# EAGLE design oTFTeatherWing-LT7688 (EAGLE 9.6.0)
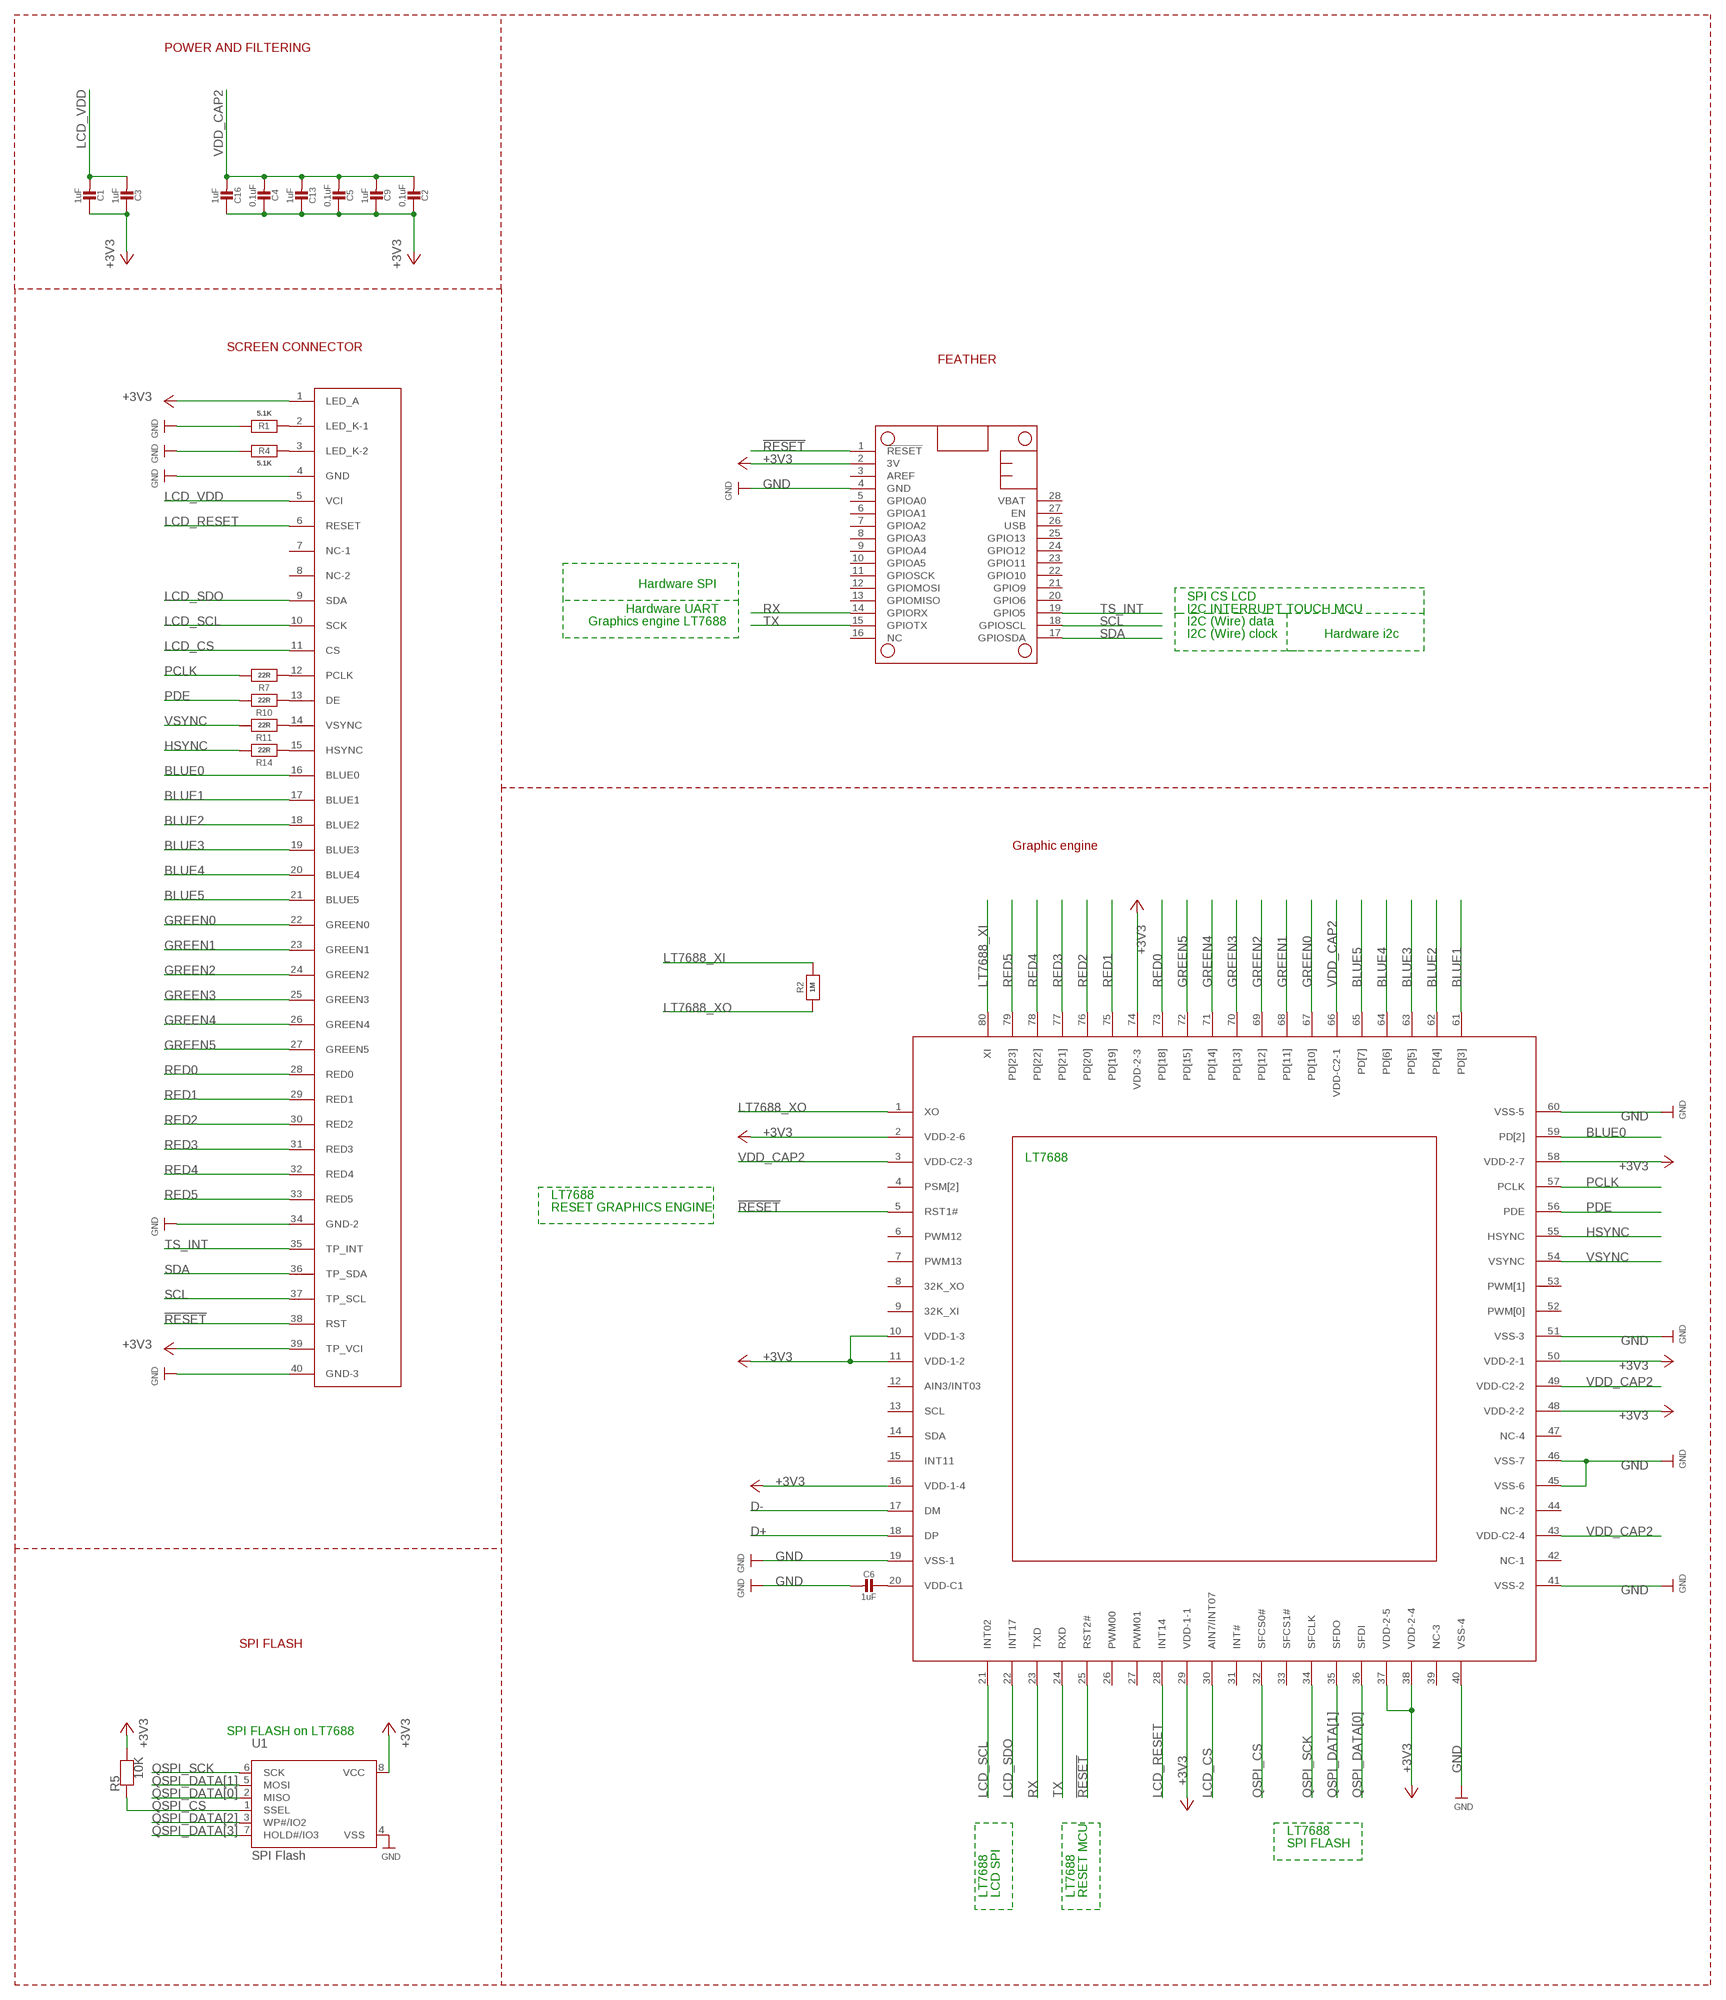
[diagram p0: schematic, sheet 1]

## Parts
C1  1uF  CAP_CERAMIC0603_NO  [0603-NO]
C2  0.1uF  CAP_CERAMIC0603_NO  [0603-NO]
C3  1uF  CAP_CERAMIC0603_NO  [0603-NO]
C4  0.1uF  CAP_CERAMIC0603_NO  [0603-NO]
C5  0.1uF  CAP_CERAMIC0603_NO  [0603-NO]
C6  1uF  CAP_CERAMIC0603_NO  [0603-NO]
C9  1uF  CAP_CERAMIC0603_NO  [0603-NO]
C13  1uF  CAP_CERAMIC0603_NO  [0603-NO]
C16  1uF  CAP_CERAMIC0603_NO  [0603-NO]
MS2  FEATHERWING  [FEATHERWING]
R1  5.1K  RESISTOR_0603_NOOUT  [0603-NO]
R2  1M  RESISTOR_0603_NOOUT  [0603-NO]
R4  5.1K  RESISTOR_0603_NOOUT  [0603-NO]
R5  10K  RESISTOR_0603_NOOUT  [0603-NO]
R7  22R  RESISTOR_0603_NOOUT  [0603-NO]
R10  22R  RESISTOR_0603_NOOUT  [0603-NO]
R11  22R  RESISTOR_0603_NOOUT  [0603-NO]
R14  22R  RESISTOR_0603_NOOUT  [0603-NO]
U1  SPI Flash  SPIFLASH_8PINUX  [USON8]
U$1  LT7688  [QFN40P900X900X70-81T710N]
U$2  FPC-LCD  [XF2M-4015-1F-REVERSE]

## Nets
!RESET: MS2.1(!RESET) U$1.5(RST1#) U$1.25(RST2#) U$2.38(RST)
+3V3 [power]: C1.1 C2.1 C3.1 C4.1 C5.1 C9.1 C13.1 C16.1 MS2.2(3V) R5.2 U1.8(VCC) U$1.2(VDD-2-6) U$1.10(VDD-1-3) U$1.11(VDD-1-2) U$1.16(VDD-1-4) U$1.29(VDD-1-1) U$1.37(VDD-2-5) U$1.38(VDD-2-4) U$1.48(VDD-2-2) U$1.50(VDD-2-1) U$1.58(VDD-2-7) U$1.74(VDD-2-3) U$2.1(LED_A) U$2.39(TP_VCI)
BLUE0: U$1.59(PD[2]) U$2.16(BLUE0)
BLUE1: U$1.61(PD[3]) U$2.17(BLUE1)
BLUE2: U$1.62(PD[4]) U$2.18(BLUE2)
BLUE3: U$1.63(PD[5]) U$2.19(BLUE3)
BLUE4: U$1.64(PD[6]) U$2.20(BLUE4)
BLUE5: U$1.65(PD[7]) U$2.21(BLUE5)
D+: U$1.18(DP)
D-: U$1.17(DM)
GND [power]: C6.2 MS2.4(GND) R1.1 R4.1 U1.4(VSS) U$1.19(VSS-1) U$1.40(VSS-4) U$1.41(VSS-2) U$1.45(VSS-6) U$1.46(VSS-7) U$1.51(VSS-3) U$1.60(VSS-5) U$2.4(GND) U$2.34(GND-2) U$2.40(GND-3)
GREEN0: U$1.67(PD[10]) U$2.22(GREEN0)
GREEN1: U$1.68(PD[11]) U$2.23(GREEN1)
GREEN2: U$1.69(PD[12]) U$2.24(GREEN2)
GREEN3: U$1.70(PD[13]) U$2.25(GREEN3)
GREEN4: U$1.71(PD[14]) U$2.26(GREEN4)
GREEN5: U$1.72(PD[15]) U$2.27(GREEN5)
HSYNC: R14.2 U$1.55(HSYNC)
LCD_CS: U$1.30(AIN7/INT07) U$2.11(CS)
LCD_RESET: U$1.28(INT14) U$2.6(RESET)
LCD_SCL: U$1.21(INT02) U$2.10(SCK)
LCD_SDO: U$1.22(INT17) U$2.9(SDA)
LCD_VDD: C1.2 C3.2 U$2.5(VCI)
LT7688_XI: R2.2 U$1.80(XI)
LT7688_XO: R2.1 U$1.1(XO)
N$2: R1.2 U$2.2(LED_K-1)
N$3: C6.1 U$1.20(VDD-C1)
N$5: R4.2 U$2.3(LED_K-2)
N$6: R7.1 U$2.12(PCLK)
N$7: R10.1 U$2.13(DE)
N$8: R11.1 U$2.14(VSYNC)
N$9: R14.1 U$2.15(HSYNC)
PCLK: R7.2 U$1.57(PCLK)
PDE: R10.2 U$1.56(PDE)
QSPI_CS: R5.1 U1.1(SSEL) U$1.32(SFCS0#)
QSPI_DATA[0]: U1.2(MISO) U$1.36(SFDI)
QSPI_DATA[1]: U1.5(MOSI) U$1.35(SFDO)
QSPI_DATA[2]: U1.3(WP#/IO2)
QSPI_DATA[3]: U1.7(HOLD#/IO3)
QSPI_SCK: U1.6(SCK) U$1.34(SFCLK)
RED0: U$1.73(PD[18]) U$2.28(RED0)
RED1: U$1.75(PD[19]) U$2.29(RED1)
RED2: U$1.76(PD[20]) U$2.30(RED2)
RED3: U$1.77(PD[21]) U$2.31(RED3)
RED4: U$1.78(PD[22]) U$2.32(RED4)
RED5: U$1.79(PD[23]) U$2.33(RED5)
RX: MS2.14(GPIORX) U$1.23(TXD)
SCL: MS2.18(GPIOSCL) U$2.37(TP_SCL)
SDA: MS2.17(GPIOSDA) U$2.36(TP_SDA)
TS_INT: MS2.19(GPIO5) U$2.35(TP_INT)
TX: MS2.15(GPIOTX) U$1.24(RXD)
VDD_CAP2: C2.2 C4.2 C5.2 C9.2 C13.2 C16.2 U$1.3(VDD-C2-3) U$1.43(VDD-C2-4) U$1.49(VDD-C2-2) U$1.66(VDD-C2-1)
VSYNC: R11.2 U$1.54(VSYNC)
Unconnected: MS2.3(AREF) MS2.5(GPIOA0) MS2.6(GPIOA1) MS2.7(GPIOA2) MS2.8(GPIOA3) MS2.9(GPIOA4) MS2.10(GPIOA5) MS2.11(GPIOSCK) MS2.12(GPIOMOSI) MS2.13(GPIOMISO) MS2.16(NC) MS2.20(GPIO6) MS2.21(GPIO9) MS2.22(GPIO10) MS2.23(GPIO11) MS2.24(GPIO12) MS2.25(GPIO13) MS2.26(USB) MS2.27(EN) MS2.28(VBAT) U$1.4(PSM[2]) U$1.6(PWM12) U$1.7(PWM13) U$1.8(32K_XO) U$1.9(32K_XI) U$1.12(AIN3/INT03) U$1.13(SCL) U$1.14(SDA) U$1.15(INT11) U$1.26(PWM00) U$1.27(PWM01) U$1.31(INT#) U$1.33(SFCS1#) U$1.39(NC-3) U$1.42(NC-1) U$1.44(NC-2) U$1.47(NC-4) U$1.52(PWM[0]) U$1.53(PWM[1]) U$2.7(NC-1) U$2.8(NC-2)

## Notes on the sheet
- POWER AND FILTERING
- SCREEN CONNECTOR
- FEATHER
- Hardware SPI
- SPI CS LCD
- Hardware UART | I2C INTERRUPT TOUCH MCU
- Graphics engine LT7688 | I2C (Wire) data
- I2C (Wire) clock | Hardware i2c
- Graphic engine
- LT7688
- LT7688
- RESET GRAPHICS ENGINE
- SPI FLASH
- SPI FLASH on LT7688
- LT7688
- SPI FLASH
- LT7688 | LCD SPI | LT7688 | RESET MCU

## Library data of the parts
C1-C6 C9 C13 C16 = microbuilder:CAP_CERAMIC: Ceramic Capacitors For new designs, use the packages preceded by an '_' character since they are more reliable: The following footprints should be used on most boards: _0402 - Standard footprint for regular board layouts _0603 - Standard footprint for regular board layouts _0805 - Standard footprint for regular board layouts _1206 - Standard footprint for regular board layouts For extremely tight-pitch boards where space is at a premium, the following 'micro-pitch' footprints can be used (smaller pads, no silkscreen outline, etc.): _0402MP - Micro-pitch footprint for very dense/compact boards _0603MP - Micro-pitch footprint for very dense/compact boards _0805MP - Micro-pitch footprint for very dense/compact boards _1206MP - Micro-pitch footprint for very dense/compact boards
MS2 = adafruit:FEATHERWING
R1 R2 R4 R5 R7 R10 R11 R14 = microbuilder:RESISTOR: Resistors For new designs, use the packages preceded by an '_' character since they are more reliable: The following footprints should be used on most boards: _0402 - Standard footprint for regular board layouts _0603 - Standard footprint for regular board layouts _0805 - Standard footprint for regular board layouts _1206 - Standard footprint for regular board layouts For extremely tight-pitch boards where space is at a premium, the following 'micro-pitch' footprints can be used (smaller pads, no silkscreen outline, etc.): _0402MP - Micro-pitch footprint for very dense/compact boards _0603MP - Micro-pitch footprint for very dense/compact boards _0805MP - Micro-pitch footprint for very dense/compact boards _1206MP - Micro-pitch footprint for very dense/compact boards
U1 = microbuilder:SPIFLASH_8PIN: SOIC8 SPI Flash Be careful with the size since SOIC8 flash comes in several 'widths' SOIC8 150 mil M25P16 - 16Mbit (2Mbit x 8) Serial Flash (75MHz SPI Bus), Supply: 2.7-3.6V Digikey: SOIC8 - M25P16-VMN6P-ND SOIC8 208 mil W25Q16BVSSIG - 16Mbit (2Mbit x 8) Serial Flash (104MHz SPI Bus), Supply: 2.7-3.6V Digikey: SOIC8 - W25Q16BVSSIG-ND
U$1 = QFN40P900X900X70-81T710N:LT7688
U$2 = QFN40P900X900X70-81T710N:FPC-LCD

## Net classes
1 power: width 0.305 mm

## Board
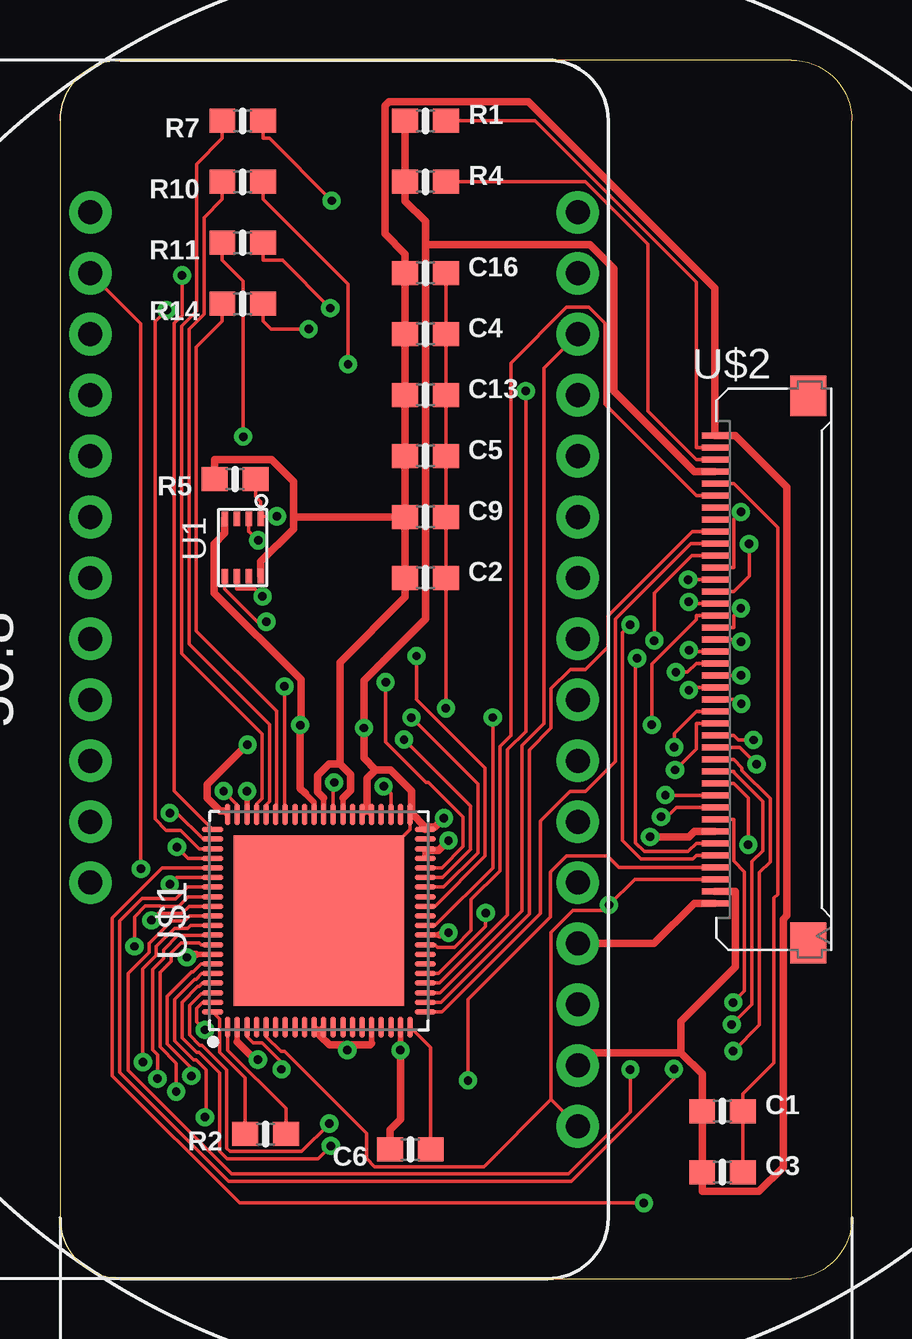
[diagram p1: board, top side]
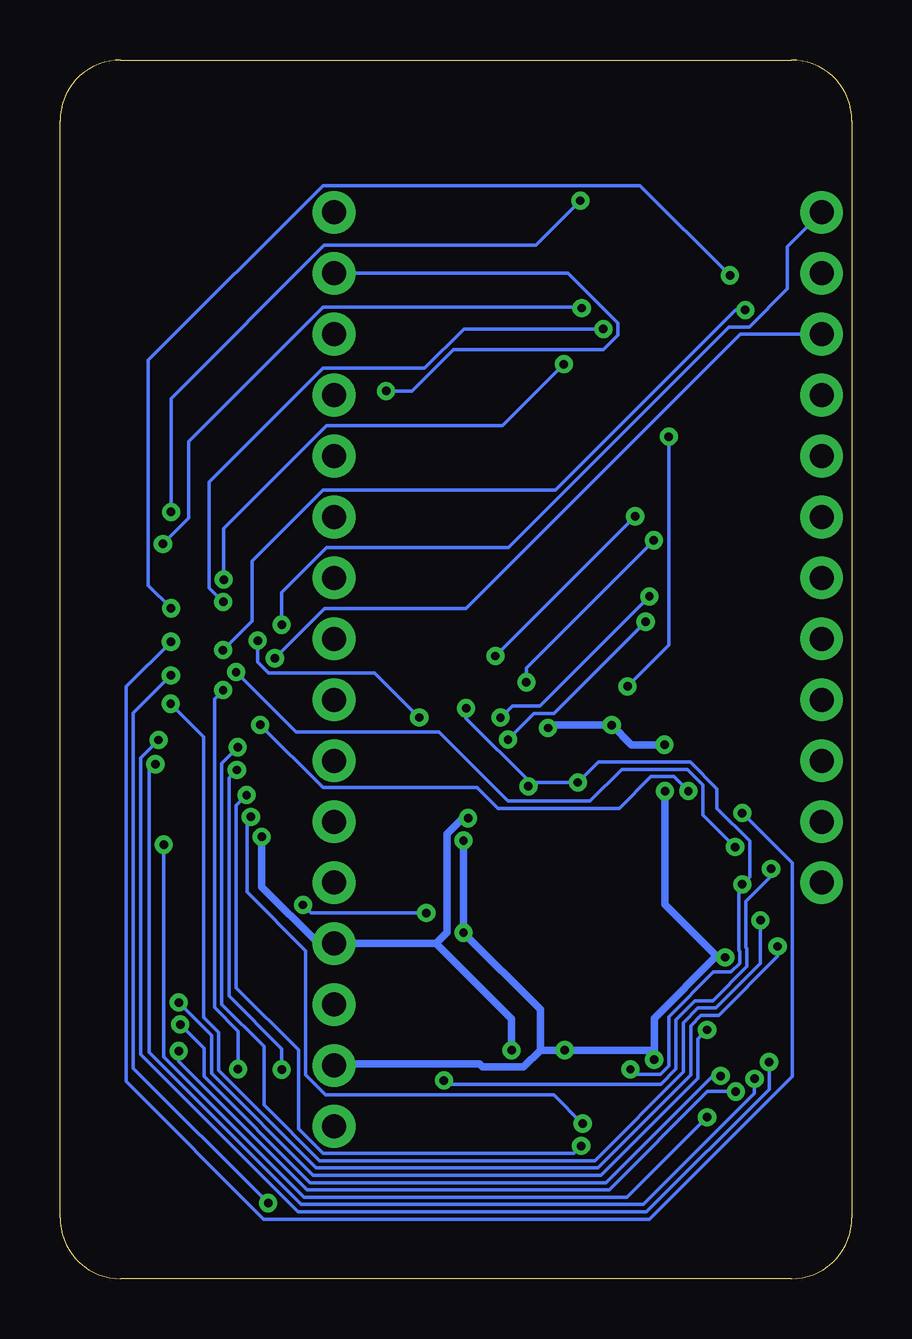
[diagram p2: board, bottom side, seen from below]

Size 33.02 x 50.8 mm. Coordinates in mm from the lower left corner, seen from the top.
Outline: 2.54,0 arc-90 0,2.54 0,48.26 arc-90 2.54,50.8 30.48,50.8 arc-90 33.02,48.26 33.02,2.54 arc-90 30.48,0 2.54,0
Copper layers (1*16): Top 0.035mm / dielectric 1.5mm / Bottom 0.035mm
Design rules "default": minimum track width 6mil, minimum drill 0.35mm, track to track 6mil, track to pad 6mil, pad to pad 6mil, via to via 6mil, smd to smd 6mil, copper to edge 40mil, drill to drill 6mil, minimum pad ring 10mil, minimum via ring 8mil, stop-mask expansion 4mil, vias tented up to drill 0mil, thermal gap 10mil

### Footprints (pad centres in the part's own frame; a part is rotated, then mirrored left to right if it is on the bottom)
0603-NO = smd 1.075 x 1: 1 -0.85,0; 2 0.85,0
FEATHERWING = drill 1 pad 1.778: 1 6.35,1.27; 2 8.89,1.27; 3 11.43,1.27; 4 13.97,1.27; 5 16.51,1.27; 6 19.05,1.27; 7 21.59,1.27; 8 24.13,1.27; 9 26.67,1.27; 10 29.21,1.27; 11 31.75,1.27; 12 34.29,1.27; 13 36.83,1.27; 14 39.37,1.27; 15 41.91,1.27; 16 44.45,1.27; 17 44.45,21.59; 18 41.91,21.59; 19 39.37,21.59; 20 36.83,21.59; 21 34.29,21.59; 22 31.75,21.59; 23 29.21,21.59; 24 26.67,21.59; 25 24.13,21.59; 26 21.59,21.59; 27 19.05,21.59; 28 16.51,21.59
USON8 = smd 0.6 x 0.275: 1 -1.2,0.75; 2 -1.2,0.25; 3 -1.2,-0.25; 4 -1.2,-0.75; 5 1.2,-0.75; 6 1.2,-0.25; 7 1.2,0.25; 8 1.2,0.75
QFN40P900X900X70-81T710N = smd 0.873 x 0.22: 1 -4.428,3.8; 2 -4.428,3.4; 3 -4.428,3; 4 -4.428,2.6; 5 -4.428,2.2; 6 -4.428,1.8; 7 -4.428,1.4; 8 -4.428,1; 9 -4.428,0.6; 10 -4.428,0.2; 11 -4.428,-0.2; 12 -4.428,-0.6; 13 -4.428,-1; 14 -4.428,-1.4; 15 -4.428,-1.8; 16 -4.428,-2.2; 17 -4.428,-2.6; 18 -4.428,-3; 19 -4.428,-3.4; 20 -4.428,-3.8; 41 4.428,-3.8; 42 4.428,-3.4; 43 4.428,-3; 44 4.428,-2.6; 45 4.428,-2.2; 46 4.428,-1.8; 47 4.428,-1.4; 48 4.428,-1; 49 4.428,-0.6; 50 4.428,-0.2; 51 4.428,0.2; 52 4.428,0.6; 53 4.428,1; 54 4.428,1.4; 55 4.428,1.8; 56 4.428,2.2; 57 4.428,2.6; 58 4.428,3; 59 4.428,3.4; 60 4.428,3.8 | smd 0.22 x 0.873: 21 -3.8,-4.428; 22 -3.4,-4.428; 23 -3,-4.428; 24 -2.6,-4.428; 25 -2.2,-4.428; 26 -1.8,-4.428; 27 -1.4,-4.428; 28 -1,-4.428; 29 -0.6,-4.428; 30 -0.2,-4.428; 31 0.2,-4.428; 32 0.6,-4.428; 33 1,-4.428; 34 1.4,-4.428; 35 1.8,-4.428; 36 2.2,-4.428; 37 2.6,-4.428; 38 3,-4.428; 39 3.4,-4.428; 40 3.8,-4.428; 61 3.8,4.428; 62 3.4,4.428; 63 3,4.428; 64 2.6,4.428; 65 2.2,4.428; 66 1.8,4.428; 67 1.4,4.428; 68 1,4.428; 69 0.6,4.428; 70 0.2,4.428; 71 -0.2,4.428; 72 -0.6,4.428; 73 -1,4.428; 74 -1.4,4.428; 75 -1.8,4.428; 76 -2.2,4.428; 77 -2.6,4.428; 78 -3,4.428; 79 -3.4,4.428; 80 -3.8,4.428 | smd 7.1 x 7.1: 81 0,0
XF2M-4015-1F-REVERSE = smd 1.1 x 0.25: 1 -2.54,9.75; 2 -2.54,9.25; 3 -2.54,8.75; 4 -2.54,8.25; 5 -2.54,7.75; 6 -2.54,7.25; 7 -2.54,6.75; 8 -2.54,6.25; 9 -2.54,5.75; 10 -2.54,5.25; 11 -2.54,4.75; 12 -2.54,4.25; 13 -2.54,3.75; 14 -2.54,3.25; 15 -2.54,2.75; 16 -2.54,2.25; 17 -2.54,1.75; 18 -2.54,1.25; 19 -2.54,0.75; 20 -2.54,0.25; 21 -2.54,-0.25; 22 -2.54,-0.75; 23 -2.54,-1.25; 24 -2.54,-1.75; 25 -2.54,-2.25; 26 -2.54,-2.75; 27 -2.54,-3.25; 28 -2.54,-3.75; 29 -2.54,-4.25; 30 -2.54,-4.75; 31 -2.54,-5.25; 32 -2.54,-5.75; 33 -2.54,-6.25; 34 -2.54,-6.75; 35 -2.54,-7.25; 36 -2.54,-7.75; 37 -2.54,-8.25; 38 -2.54,-8.75; 39 -2.54,-9.25; 40 -2.54,-9.75 | smd 1.5 x 1.7: M1 1.36,11.4; M2 1.36,-11.4

### Placement (x,y rotation side)
C1  27.62,6.98 0 top
C2  15.24,29.21 0 top
C3  27.62,4.45 0 top
C4  15.24,39.37 0 top
C5  15.24,34.29 0 top
C6  14.6,5.4 180 top
C9  15.24,31.75 0 top
C13  15.24,36.83 0 top
C16  15.24,41.91 0 top
MS2  22.86,0 90 top
R1  15.24,48.26 0 top
R2  8.57,6.03 180 top
R4  15.24,45.72 0 top
R5  7.3,33.34 180 top
R7  7.62,48.26 180 top
R10  7.62,45.72 180 top
R11  7.62,43.18 180 top
R14  7.62,40.64 180 top
U1  7.62,30.48 270 top
U$1  10.79,14.92 90 top
U$2  29.84,25.4 0 top

### Tracks (layer width: path | path; a pad name or v marks a point on that pad's centre or on a via)
!RESET  (via drill 0.35 pad 0.76)
  Top 0.152: 20.47,7.47 MS2.1 | 20.47,7.47 20.47,14.44 21.38,15.35 22.66,15.35 v22.89,15.58 23.96,16.65 U$2.38 | 20.47,7.47 17.67,4.67 13.12,4.67 12.77,5.02 12.77,6.05 9.35,9.47 9.21,9.47 8.6,10.09 U$1.5 | v17.75,15.24 17.75,14.68 15.79,12.72 U$1.25
  Bottom 0.152: v22.89,15.58 22.55,15.24 v17.75,15.24
+3V3  (via drill 0.35 pad 0.76)
  Top 0.22: 7.39,9.86 U$1.2 | 12.99,9.8 U$1.16 | 10.74,10.35 U$1.10 | 10.85,10.35 U$1.11 | 10.99,20.03 U$1.50 | 11.79,20.03 U$1.48 | 7.79,20.04 U$1.58 | 15.3,17.84 U$1.38 U$1.37 | 5.68,13.52 U$1.74 | 15.83,14.32 U$1.29
  Top 0.305: 7.39,9.86 8.12,9.13 v8.25,9.13 | v11.98,9.53 11.98,9.75 | 11.98,9.75 11.23,9.75 10.85,10.12 10.85,10.35 10.74,10.35 | 11.98,9.75 12.94,9.75 12.99,9.8 | 11.79,20.03 12.12,20.35 12.12,21.02 11.68,21.46 | 7.79,20.04 v7.79,20.32 | 15.83,14.32 16.1,14.32 v16.2,14.42 | 11.68,21.46 11.68,25.7 14.39,28.41 C2.1 14.39,30.95 C9.1 | 11.68,21.46 11.23,21.46 10.75,20.98 10.75,20.28 10.99,20.03 | 9.73,31.75 9.73,31.25 8.37,29.88 U1.8 | 9.73,31.75 9.73,33.23 8.82,34.14 6.45,34.14 R5.2 | 9.73,31.75 13.55,31.75 C9.1 | 5.68,13.52 5.42,13.52 v5.29,13.39 | 25.89,9.42 26.77,8.53 26.77,7.79 C1.1 26.77,6.18 26.77,5.25 26.77,4.73 C3.1 26.77,3.64 29.14,3.64 30.15,4.65 30.15,14.98 30.31,15.13 30.31,33 28.16,35.15 U$2.1 27.3,41.29 19.53,49.07 13.72,49.07 13.55,48.89 13.55,43.56 14.39,42.71 C16.1 C4.1 14.39,38.56 14.39,37.63 C13.1 14.39,36.02 C5.1 C9.1 | 25.89,9.42 25.89,10.73 28.16,13 28.16,16.15 U$2.39 | 25.89,9.42 22.12,9.42 MS2.2 | 15.3,17.84 15.78,17.84 v16.2,18.26
  Bottom 0.305: 8.25,9.53 v8.25,9.13 | 8.25,9.53 v11.98,9.53 12.99,9.53 | 5.64,13.46 8.25,10.86 8.25,9.53 | 5.64,13.46 7.79,15.61 v7.79,20.32 | v7.79,20.32 | v16.2,18.26 v16.2,14.42 12.99,11.22 12.99,9.53 | 5.64,13.46 5.36,13.46 v5.29,13.39 | MS2.2 21.53,8.95 15.53,8.95 15.41,8.83 13.69,8.83 12.99,9.53
BLUE0  (via drill 0.35 pad 0.76)
  Top 0.152: v24.67,23.09 24.67,25.62 26.53,27.48 26.53,27.65 U$2.16 | v6.82,20.33 7.39,19.75 U$1.59
  Bottom 0.152: v6.82,20.33 7.42,20.93 8.38,20.93 9.69,19.61 14.77,19.61 15.63,20.47 22.05,20.47 v24.67,23.09
BLUE1  (via drill 0.35 pad 0.76)
  Top 0.152: U$1.61 4.77,20.32 4.77,39.83 5.09,40.15 v5.09,41.82 | v28.39,27.95 28.08,27.64 28.08,27.15 U$2.17
  Bottom 0.152: v28.39,27.95 29.34,28.9 29.34,38.28 22.05,45.57 8.83,45.57 v5.09,41.82
BLUE2  (via drill 0.35 pad 0.76)
  Top 0.152: v28.4,26.55 28.18,26.55 28.08,26.65 U$2.18 | v4.57,19.41 4.87,19.41 5.96,18.32 U$1.62
  Bottom 0.152: v4.57,19.41 2.49,17.33 2.49,8.43 8.44,2.48 24.52,2.48 30.27,8.22 30.27,24.68 v28.4,26.55
BLUE3  (via drill 0.35 pad 0.76)
  Top 0.152: U$1.63 5.8,17.92 5.03,18.69 4.43,18.69 3.97,19.16 3.97,39.89 v4.45,40.38 | U$2.19 26.27,26.15 v26.22,26.2
  Bottom 0.152: v26.22,26.2 25.01,27.42 25.01,29.92 22.05,32.87 12.36,32.87 4.86,40.38 v4.45,40.38
BLUE4  (via drill 0.35 pad 0.76)
  Top 0.152: v25.68,25.29 26.16,25.29 26.53,25.65 U$2.20 | v4.88,17.99 5.35,17.52 U$1.64
  Bottom 0.152: v4.88,17.99 6.21,19.33 6.21,20.58 6.87,21.24 9.6,21.24 10.92,19.91 14.34,19.91 17.21,22.78 23.18,22.78 v25.68,25.29
BLUE5  (via drill 0.35 pad 0.76)
  Top 0.152: v24.34,3.15 7.49,3.15 2.19,8.46 2.19,15.04 4.27,17.12 U$1.65 | U$2.21 v28.4,25.15
  Bottom 0.152: v28.4,25.15 29.96,23.58 29.96,8.78 v24.34,3.15
GND  (via drill 0.35 pad 0.76)
  Top 0.152: U$1.41 14.6,18.72 13.97,18.1
  Top 0.22: 12.74,19.49 U$1.46 | 12.85,19.49 U$1.45 | 6.85,19.49 U$1.60 | 14.65,19.41 U$1.41 | 10.23,20.22 10.23,20.21 10.6,19.84 U$1.51 | 15.22,18.74 U$1.40 | 14.19,9.8 U$1.19
  Top 0.305: 15.23,43.1 15.23,44.07 14.39,44.91 R4.1 R1.1 | 15.23,43.1 15.23,27.49 12.67,24.93 v12.67,22.96 12.67,21.7 13.17,21.21 | 15.23,43.1 22.09,43.1 23.1,42.09 23.1,37 26.45,33.65 U$2.4 | 12.81,19.54 12.85,19.49 | 13.17,21.21 12.81,20.85 12.81,19.54 | 12.81,19.54 12.78,19.54 12.74,19.49 | v7.82,22.26 7.79,22.26 6.14,20.61 6.14,20.04 6.69,19.49 6.85,19.49 | 13.17,21.21 13.78,21.21 14.65,20.33 14.65,19.41 15.22,18.83 | 15.22,18.83 15.22,18.74 | 15.22,18.83 15.64,18.83 v16,19.19 | v24.61,18.42 26.22,18.42 26.45,18.65 U$2.34 | U$2.40 26.45,15.65 24.77,13.97 MS2.4 | 10.23,20.22 10.02,20.43 v10.02,23.07 10.04,23.1 10.04,24.97 6.43,28.59 6.43,30.63 6.87,31.08 U1.4 | C6.2 13.76,6.2 14.19,6.64 v14.19,9.52 14.19,9.8
  Bottom 0.305: v12.67,22.96 12.56,23.07 v10.02,23.07 9.2,22.26 v7.82,22.26 | v24.61,18.42 24.61,16.33 22.24,13.97 MS2.4 17.34,13.97 | 17.34,13.97 16.88,14.43 16.88,18.54 16.23,19.19 v16,19.19 | 17.34,13.97 14.19,10.82 v14.19,9.52
GREEN0  (via drill 0.35 pad 0.76)
  Top 0.152: v25.6,8.74 25.6,8.34 21.31,4.05 7.04,4.05 2.5,8.59 2.5,14.92 3.43,15.85 4.3,15.85 4.32,15.83 4.83,15.83 5.32,16.32 U$1.67 | U$2.22 26.34,24.65 v26.22,24.53
  Bottom 0.152: v25.6,8.74 | v25.6,8.74 25.6,10.32 26.58,11.3 26.58,24.17 v26.22,24.53
GREEN1  (via drill 0.35 pad 0.76)
  Top 0.152: v3.11,13.85 3.11,15.09 3.56,15.55 4.18,15.55 4.2,15.53 4.95,15.53 5.35,15.92 U$1.68 | U$2.23 28.22,24.15 v28.4,23.96
  Bottom 0.152: v3.11,13.85 3.11,13.43 5.56,10.98 6.29,10.98 6.73,10.54 6.73,8.49 10.6,4.62 22.34,4.62 26.4,8.68 26.4,10.28 27.02,10.9 27.02,22.58 v28.4,23.96
GREEN2  (via drill 0.35 pad 0.76)
  Top 0.152: v3.81,14.94 4.1,15.22 5.08,15.22 5.38,15.52 U$1.69 | v25.61,22.15 25.61,22.73 26.53,23.65 U$2.24
  Bottom 0.152: v3.81,14.94 3.81,13.15 5.69,11.28 6.42,11.28 7.03,10.67 7.03,8.62 10.72,4.92 22.19,4.92 24.51,7.25 24.51,9.68 26.28,11.45 26.28,21.48 v25.61,22.15
GREEN3  (via drill 0.35 pad 0.76)
  Top 0.152: v25.65,21.21 26.53,22.09 26.53,23.15 U$2.25 | v23.77,8.72 23.77,6.95 21.19,4.36 7.16,4.36 2.85,8.68 2.85,12.74 3.71,13.6 3.71,13.97 4.66,14.92 5.21,14.92 5.41,15.12 U$1.70
  Bottom 0.152: v23.77,8.72 23.77,9.59 25.97,11.79 25.97,20.88 v25.65,21.21
GREEN4  (via drill 0.35 pad 0.76)
  Top 0.152: v3.46,9.03 3.46,12.91 4.02,13.47 4.02,13.84 4.78,14.61 5.33,14.61 5.44,14.72 U$1.71 | v28.91,22.45 28.28,22.45 28.08,22.65 U$2.26
  Bottom 0.152: v28.91,22.45 29.65,21.71 29.65,9.35 23.09,2.79 8.57,2.79 3.46,7.9 v3.46,9.03
GREEN5  (via drill 0.35 pad 0.76)
  Top 0.152: v4.06,8.34 4.06,9.34 3.87,9.53 3.87,12.89 4.32,13.35 4.32,13.71 4.92,14.31 6.35,14.31 U$1.72 | U$2.27 28.34,22.15 v29.04,21.44
  Bottom 0.152: v29.04,21.44 29.3,21.18 29.3,9.43 22.97,3.09 8.7,3.09 4.06,7.72 v4.06,8.34
HSYNC
  Top 0.152: U$1.55 9.03,19.39 9.03,23.66 5.69,27 5.69,38.83 6.77,39.91 R14.2
LCD_CS  (via drill 0.35 pad 0.76)
  Top 0.152: U$2.11 26.34,30.15 24.78,28.59 v24.78,26.6 | U$1.30 15.63,14.72 18.04,17.13 v18.04,23.39
  Bottom 0.152: v18.04,23.39 19.9,25.26 24.31,25.26 24.78,25.72 v24.78,26.6 | v24.78,26.6
LCD_RESET
  Top 0.152: U$1.28 15.63,13.92 15.74,13.81 16.45,13.81 17.14,14.51 17.14,15.8 18.35,17 18.35,22.18 18.8,22.63 18.8,38.17 21.12,40.49 22.06,40.49 22.72,39.83 22.72,36.46 26.53,32.65 U$2.6
LCD_SCL
  Top 0.152: U$1.21 15.92,11.12 20.02,15.23 20.02,19.07 21.27,20.32 21.91,20.32 23.15,21.56 23.15,27.49 26.31,30.65 U$2.10
LCD_SDO
  Top 0.152: U$1.22 15.88,11.52 19.57,15.21 19.57,22.04 20.47,22.95 20.47,24.59 21.28,25.4 21.91,25.4 22.85,26.34 22.85,27.62 26.37,31.15 U$2.9
LCD_VDD
  Top 0.152: U$2.5 28.08,33.15 29.92,31.31 29.92,16.02 29.77,15.87 29.77,9.01 28.47,7.71 C1.2 28.47,6.26 28.47,5.17 C3.2
LT7688_XI
  Top 0.152: U$1.80 6.65,10.84 6.65,9.44 7.72,8.36 7.72,6.76 R2.2
LT7688_XO
  Top 0.152: U$1.1 6.99,9.52 9.42,7.09 9.42,6.76 R2.1
N$2
  Top 0.152: U$2.2 26.53,34.65 26.53,41.53 19.8,48.26 R1.2
N$3
  Top 0.152: U$1.20 15.46,9.63 15.46,6.13 C6.1
N$5
  Top 0.152: U$2.3 26.53,34.15 24.51,36.16 24.51,43.11 21.9,45.72 R4.2
N$6  (via drill 0.35 pad 0.76)
  Top 0.152: v28.39,31.96 28.08,31.66 28.08,29.65 U$2.12 | v11.33,44.94 8.73,47.53 8.47,47.53 R7.1
  Bottom 0.152: v11.33,44.94 13.18,43.09 22,43.09 28.39,36.7 v28.39,31.96
N$7  (via drill 0.35 pad 0.76)
  Top 0.152: v26.19,29.14 v26.2,29.15 26.53,29.15 U$2.13 | v12.01,38.12 12.01,41.45 8.47,44.99 R10.1
  Bottom 0.152: v12.01,38.12 14.57,35.56 21.9,35.56 26.19,31.27 v26.19,29.14
N$8  (via drill 0.35 pad 0.76)
  Top 0.152: v11.27,40.46 9.28,42.45 8.47,42.45 R11.1 | v28.73,30.63 28.73,29.3 28.08,28.65 U$2.14
  Bottom 0.152: v11.27,40.46 11.3,40.49 22.06,40.49 27.65,34.89 27.65,31.7 | 27.65,31.7 | 27.65,31.7 v28.73,30.63
N$9  (via drill 0.35 pad 0.76)
  Top 0.152: U$2.15 26.27,28.15 v26.21,28.21 | R14.1 8.47,39.91 8.8,39.59 v10.37,39.59
  Bottom 0.152: v10.37,39.59 16.18,39.59 17.82,37.95 22.05,37.95 26.8,33.2 26.8,28.8 v26.21,28.21
PCLK
  Top 0.152: U$1.57 8.2,19.79 8.43,20.02 8.43,22.7 5.07,26.05 5.07,39.71 5.7,40.33 5.7,46.46 6.77,47.53 R7.2
PDE
  Top 0.152: U$1.56 8.6,19.75 8.73,19.89 8.73,23.1 5.38,26.45 5.38,39.58 6,40.2 6,44.22 6.77,44.99 R10.2
QSPI_CS  (via drill 0.35 pad 0.76)
  Top 0.152: U$1.32 15.63,15.52 17.73,17.62 17.73,21.28 14.87,24.14 v14.87,25.95 | 8.37,31.78 8.37,32.39 8.15,32.61 R5.1 | U1.1 8.37,31.78 | v9.04,31.78 8.37,31.78
  Bottom 0.152: v9.04,31.78 v14.87,25.95 | v14.87,25.95
QSPI_DATA[0]  (via drill 0.35 pad 0.76)
  Top 0.152: v8.26,30.78 7.89,31.15 7.87,31.15 U1.2 | v13.58,24.87 13.58,22.38 15.27,20.69 15.37,20.69 16.81,19.25 16.81,18.01 15.92,17.12 U$1.36
  Bottom 0.152: v13.58,24.87 13.58,25.46 v8.26,30.78
QSPI_DATA[1]  (via drill 0.35 pad 0.76)
  Top 0.152: U$1.35 15.95,16.72 17.11,17.89 17.11,19.7 v14.34,22.47 | v8.61,27.38 8.24,27.38 6.87,28.75 U1.5
  Bottom 0.152: v8.61,27.38 12.42,23.56 13.25,23.56 v14.34,22.47
QSPI_SCK  (via drill 0.35 pad 0.76)
  Top 0.152: v8.45,28.44 8.14,28.75 7.37,28.75 U1.6 | v14.65,23.39 17.42,20.62 17.42,17.76 15.99,16.32 U$1.34
  Bottom 0.152: v14.65,23.39 14.16,23.88 13.01,23.88 v8.45,28.44
RED0  (via drill 0.35 pad 0.76)
  Top 0.152: v4.85,7.8 4.85,8.99 4.17,9.66 4.17,12.77 4.63,13.22 4.63,13.59 5.04,14 5.8,14 5.88,13.92 U$1.73 | v28.07,9.49 29.16,10.57 29.16,16.93 29.61,17.38 29.61,20.02 28.44,21.19 28.44,21.3 28.08,21.65 U$2.28
  Bottom 0.152: v4.85,7.8 6.02,7.8 10.12,3.7 22.72,3.7 28.07,9.06 v28.07,9.49
RED1  (via drill 0.35 pad 0.76)
  Top 0.152: v5.48,8.45 5.48,8.78 4.48,9.79 4.48,11.77 5.5,12.79 5.54,12.79 5.88,13.12 U$1.75 | v28.01,10.6 28.85,11.44 28.85,17.39 29.31,17.84 29.31,19.89 28.08,21.11 28.08,21.15 U$2.29
  Bottom 0.152: v5.48,8.45 5.8,8.45 10.25,4.01 22.59,4.01 27.01,8.43 27.01,9.6 v28.01,10.6
RED2  (via drill 0.35 pad 0.76)
  Top 0.152: v28.69,18.09 28.69,20.04 28.08,20.65 U$2.30 | v6.04,6.73 6.09,6.78 6.09,8.7 5.67,9.12 5.57,9.12 4.78,9.91 4.78,11.64 5.62,12.48 5.67,12.48 5.91,12.72 U$1.76
  Bottom 0.152: v6.04,6.73 9.38,3.4 22.84,3.4 28.69,9.25 v28.69,18.09
RED3  (via drill 0.35 pad 0.76)
  Top 0.152: v25.24,20.16 v25.25,20.15 26.53,20.15 U$2.31 | v11.29,5.54 10.75,5 6.96,5 6.65,5.31 6.65,8.57 5.79,9.43 5.7,9.43 5.09,10.04 5.09,11.52 5.75,12.18 5.8,12.18 5.94,12.32 U$1.77
  Bottom 0.152: v11.29,5.54 11.6,5.23 22.06,5.23 23.08,6.25 23.08,9.54 25.67,12.13 25.67,19.73 v25.24,20.16
RED4  (via drill 0.35 pad 0.76)
  Top 0.152: U$2.32 25.7,19.65 25.3,19.25 v25.06,19.25 | v11.23,6.47 10.07,5.3 7.08,5.3 6.96,5.43 6.96,8.7 5.92,9.73 5.82,9.73 5.4,10.16 5.4,11.39 5.88,11.87 6.32,11.87 U$1.78
  Bottom 0.152: v11.23,6.47 12.42,7.66 21.95,7.66 22.77,8.49 22.77,13.68 25.21,16.11 25.21,19.1 v25.06,19.25
RED5  (via drill 0.35 pad 0.76)
  Top 0.152: v28.07,11.52 28.54,11.99 28.54,16.95 28.08,17.41 28.08,19.15 U$2.33 | U$1.79 5.96,11.52 5.7,11.27 5.7,10.71 v6.04,10.37
  Bottom 0.152: v6.04,10.37 6.42,9.99 6.42,8.36 10.47,4.31 22.46,4.31 26.7,8.55 26.7,10.15 v28.07,11.52
RX
  Top 0.152: MS2.14 20.17,37.95 20.17,23.14 19.25,22.22 19.25,15.32 15.85,11.92 U$1.23
SCL  (via drill 0.35 pad 0.76)
  Top 0.152: v17.01,8.26 17.01,11.64 20.45,15.08 20.45,16.96 21.12,17.63 22.82,17.63 23.3,17.15 26.53,17.15 U$2.37 | MS2.18 3.37,39.81 v3.37,17.09
  Bottom 0.152: v3.37,17.09 3.37,16.78 4.42,15.73 4.42,13.81 4.38,13.77 4.38,13.02 5.81,11.59 6.55,11.59 7.34,10.8 7.34,8.74 7.97,8.11 16.86,8.11 v17.01,8.26
SDA  (via drill 0.35 pad 0.76)
  Top 0.152: v23.77,27.26 23.46,26.94 23.46,18.27 24.23,17.5 26.38,17.5 26.53,17.65 U$2.36
  Bottom 0.152: MS2.17 2.69,43.03 2.69,41.27 4.29,39.67 5.13,39.67 14.33,30.48 21.9,30.48 23.77,28.61 v23.77,27.26
TS_INT  (via drill 0.35 pad 0.76)
  Top 0.152: v24.06,25.86 24,25.8 24,18.17 24.36,17.81 26.19,17.81 26.53,18.15 U$2.35
  Bottom 0.152: MS2.19 4.65,39.37 16.09,27.94 21.99,27.94 v24.06,25.86
TX  (via drill 0.35 pad 0.76)
  Top 0.152: v19.42,37 19.42,22.82 18.65,22.05 18.65,15.16 15.82,12.32 U$1.24
  Bottom 0.152: MS2.15 11.84,41.91 9.76,39.84 9.76,39.34 10.37,38.72 16.61,38.72 18.33,37 v19.42,37
VDD_CAP2  (via drill 0.35 pad 0.76)
  Top 0.152: v16.09,23.78 C2.2 C9.2 C5.2 C13.2 C4.2 C16.2 | v11.43,20.69 11.4,20.65 U$1.49 | v13.49,20.52 13.79,20.22 U$1.43 | v4.58,16.44 4.86,16.72 U$1.66 | U$1.3 7.79,10.09 8.06,9.83 8.42,9.83 9.24,9.01 v9.24,8.72
  Bottom 0.152: v9.24,8.72 9.03,8.52 8,8.52 7.64,8.88 7.64,10.92 5.78,12.79 5.04,12.79 4.69,13.14 4.69,13.65 4.73,13.69 4.73,16.29 v4.58,16.44 4.27,16.75 4.27,18.24 5.62,19.6 5.62,20.42 6.75,21.54 10.58,21.54 v11.43,20.69 13.36,20.69 13.39,20.66 | 13.39,20.66 16.09,23.36 v16.09,23.78 | 13.39,20.66 13.49,20.56 v13.49,20.52
VSYNC  (via drill 0.35 pad 0.76)
  Top 0.152: v7.64,35.09 7.64,41.58 6.77,42.45 R11.2 | U$1.54 9.36,19.39 v9.36,24.69
  Bottom 0.152: v9.36,24.69 7.64,26.41 v7.64,35.09 | v7.64,35.09